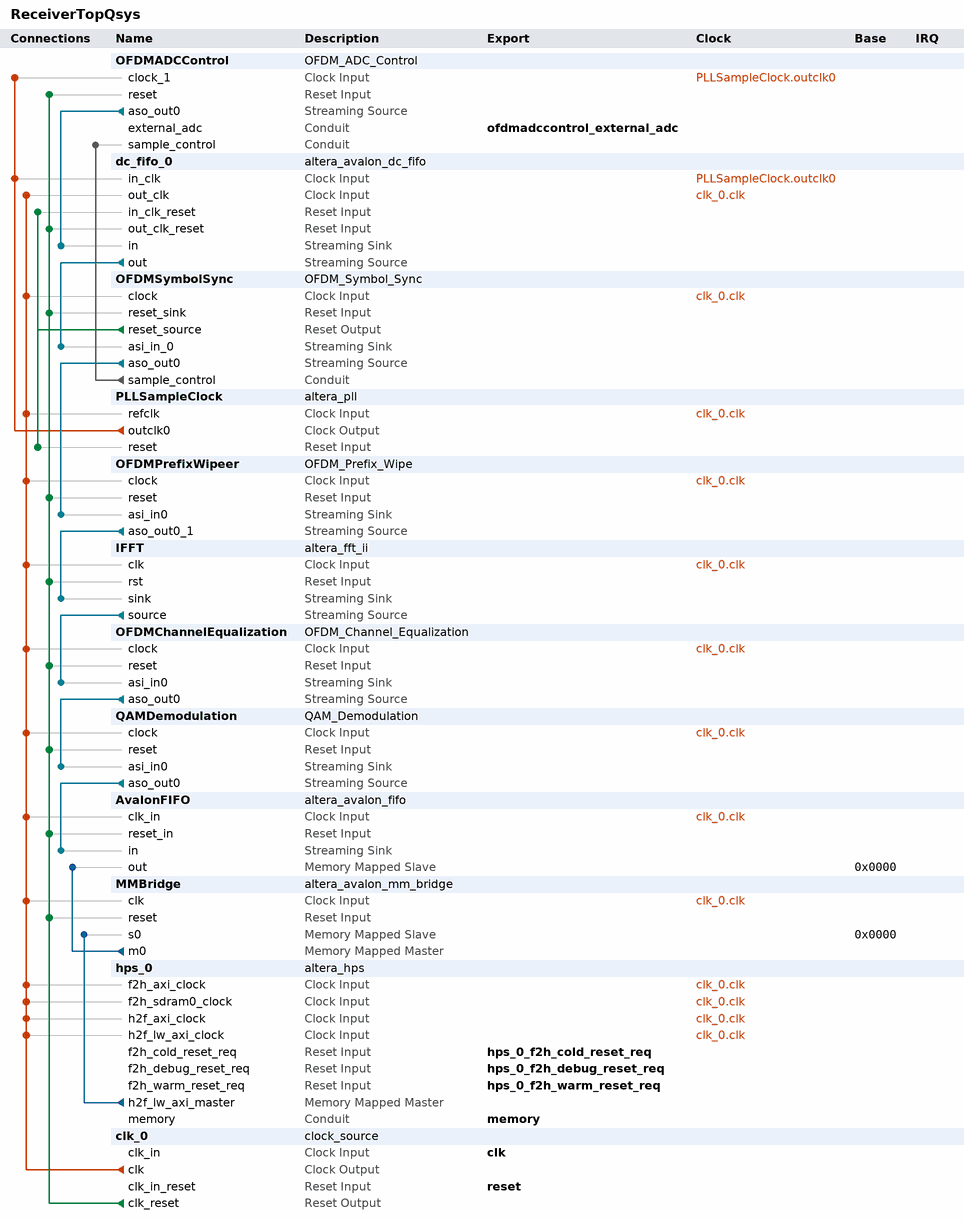
[diagram p0: system contents]
# Platform Designer (Qsys) system ReceiverTopQsys, Cyclone V 5CSXFC6D6F31C6
# Parameters at their usual value, and those the tool derives, are not listed.
package require -exact qsys 18.0
create_system ReceiverTopQsys
set_project_property DEVICE_FAMILY {Cyclone V}
set_project_property DEVICE 5CSXFC6D6F31C6

add_instance OFDMADCControl OFDM_ADC_Control 1.0

add_instance dc_fifo_0 altera_avalon_dc_fifo 18.0
set_instance_parameter_value dc_fifo_0 BITS_PER_SYMBOL 32
set_instance_parameter_value dc_fifo_0 FIFO_DEPTH 1024
set_instance_parameter_value dc_fifo_0 USE_PACKETS 1

add_instance OFDMSymbolSync OFDM_Symbol_Sync 1.0

add_instance PLLSampleClock altera_pll 18.0
set_instance_parameter_value PLLSampleClock gui_device_speed_grade 2
set_instance_parameter_value PLLSampleClock gui_number_of_clocks 1
set_instance_parameter_value PLLSampleClock gui_operation_mode direct
set_instance_parameter_value PLLSampleClock gui_output_clock_frequency0 40.0
set_instance_parameter_value PLLSampleClock gui_pll_mode {Fractional-N PLL}
set_instance_parameter_value PLLSampleClock gui_reference_clock_frequency 50.0
set_instance_parameter_value PLLSampleClock gui_use_locked true

add_instance OFDMPrefixWipeer OFDM_Prefix_Wipe 1.0

add_instance IFFT altera_fft_ii 18.0
set_instance_parameter_value IFFT data_flow Streaming
set_instance_parameter_value IFFT data_rep {Block Floating Point}
set_instance_parameter_value IFFT engine_arch {Quad Output}
set_instance_parameter_value IFFT in_width 14
set_instance_parameter_value IFFT length 1024
set_instance_parameter_value IFFT out_order Natural
set_instance_parameter_value IFFT out_width 29
set_instance_parameter_value IFFT twid_width 14

add_instance OFDMChannelEqualization OFDM_Channel_Equalization 1.0

add_instance QAMDemodulation QAM_Demodulation 1.0

add_instance AvalonFIFO altera_avalon_fifo 18.0
set_instance_parameter_value AvalonFIFO bitsPerSymbol 8
set_instance_parameter_value AvalonFIFO channelWidth 8
set_instance_parameter_value AvalonFIFO errorWidth 8
set_instance_parameter_value AvalonFIFO fifoDepth 16
set_instance_parameter_value AvalonFIFO fifoInputInterfaceOptions AVALONST_SINK
set_instance_parameter_value AvalonFIFO fifoOutputInterfaceOptions AVALONMM_READ
set_instance_parameter_value AvalonFIFO singleClockMode true
set_instance_parameter_value AvalonFIFO symbolsPerBeat 4
set_instance_parameter_value AvalonFIFO useIRQ true
set_instance_parameter_value AvalonFIFO usePacket true
set_instance_parameter_value AvalonFIFO useReadControl false

add_instance MMBridge altera_avalon_mm_bridge 18.0
set_instance_parameter_value MMBridge ADDRESS_UNITS SYMBOLS
set_instance_parameter_value MMBridge ADDRESS_WIDTH 10
set_instance_parameter_value MMBridge DATA_WIDTH 32
set_instance_parameter_value MMBridge MAX_PENDING_RESPONSES 4
set_instance_parameter_value MMBridge USE_AUTO_ADDRESS_WIDTH 0

add_instance hps_0 altera_hps 18.0
set_instance_parameter_value hps_0 EMAC1_Mode RGMII
set_instance_parameter_value hps_0 EMAC1_PinMuxing {HPS I/O Set 0}
set_instance_parameter_value hps_0 F2SCLK_COLDRST_Enable true
set_instance_parameter_value hps_0 F2SCLK_DBGRST_Enable true
set_instance_parameter_value hps_0 F2SCLK_WARMRST_Enable true
set_instance_parameter_value hps_0 F2SDRAM_Type {Avalon-MM Bidirectional}
set_instance_parameter_value hps_0 F2SDRAM_Width 64
set_instance_parameter_value hps_0 F2SINTERRUPT_Enable true
set_instance_parameter_value hps_0 F2S_Width 2
set_instance_parameter_value hps_0 FPGA_PERIPHERAL_OUTPUT_CLOCK_FREQ_EMAC0_GTX_CLK 125
set_instance_parameter_value hps_0 FPGA_PERIPHERAL_OUTPUT_CLOCK_FREQ_EMAC0_MD_CLK 2.5
set_instance_parameter_value hps_0 FPGA_PERIPHERAL_OUTPUT_CLOCK_FREQ_EMAC1_GTX_CLK 125
set_instance_parameter_value hps_0 FPGA_PERIPHERAL_OUTPUT_CLOCK_FREQ_EMAC1_MD_CLK 2.5
set_instance_parameter_value hps_0 HPS_PROTOCOL DDR3
set_instance_parameter_value hps_0 I2C0_Mode N/A
set_instance_parameter_value hps_0 I2C0_PinMuxing Unused
set_instance_parameter_value hps_0 I2C1_Mode N/A
set_instance_parameter_value hps_0 I2C1_PinMuxing Unused
set_instance_parameter_value hps_0 LWH2F_Enable true
set_instance_parameter_value hps_0 MEM_BANKADDR_WIDTH 3
set_instance_parameter_value hps_0 MEM_CLK_FREQ 400.0
set_instance_parameter_value hps_0 MEM_COL_ADDR_WIDTH 10
set_instance_parameter_value hps_0 MEM_DQ_WIDTH 32
set_instance_parameter_value hps_0 MEM_DRV_STR RZQ/6
set_instance_parameter_value hps_0 MEM_ROW_ADDR_WIDTH 15
set_instance_parameter_value hps_0 MEM_RTT_NOM {ODT Disabled}
set_instance_parameter_value hps_0 MEM_RTT_WR {Dynamic ODT off}
set_instance_parameter_value hps_0 MEM_TCL 11
set_instance_parameter_value hps_0 MEM_TFAW_NS 45.0
set_instance_parameter_value hps_0 MEM_TRAS_NS 35.0
set_instance_parameter_value hps_0 MEM_TRCD_NS 13.75
set_instance_parameter_value hps_0 MEM_TRFC_NS 260.0
set_instance_parameter_value hps_0 MEM_TRP_NS 13.75
set_instance_parameter_value hps_0 MEM_VENDOR Micron
set_instance_parameter_value hps_0 MEM_WTCL 7
set_instance_parameter_value hps_0 QSPI_Mode {1 SS}
set_instance_parameter_value hps_0 QSPI_PinMuxing {HPS I/O Set 0}
set_instance_parameter_value hps_0 REF_CLK_FREQ 50.0
set_instance_parameter_value hps_0 S2FCLK_USER2CLK 5
set_instance_parameter_value hps_0 S2F_Width 2
set_instance_parameter_value hps_0 SDIO_Mode {4-bit Data}
set_instance_parameter_value hps_0 SDIO_PinMuxing {HPS I/O Set 0}
set_instance_parameter_value hps_0 SPIM1_Mode N/A
set_instance_parameter_value hps_0 SPIM1_PinMuxing Unused
set_instance_parameter_value hps_0 STM_Enable true
set_instance_parameter_value hps_0 TIMING_BOARD_AC_SKEW 0.02
set_instance_parameter_value hps_0 TIMING_BOARD_AC_TO_CK_SKEW 0.01
set_instance_parameter_value hps_0 TIMING_BOARD_DQ_TO_DQS_SKEW 0.05
set_instance_parameter_value hps_0 TIMING_BOARD_MAX_CK_DELAY 0.03
set_instance_parameter_value hps_0 TIMING_BOARD_MAX_DQS_DELAY 0.02
set_instance_parameter_value hps_0 TIMING_BOARD_SKEW_BETWEEN_DQS 0.06
set_instance_parameter_value hps_0 TIMING_BOARD_SKEW_CKDQS_DIMM_MAX 0.12
set_instance_parameter_value hps_0 TIMING_BOARD_SKEW_CKDQS_DIMM_MIN 0.06
set_instance_parameter_value hps_0 TIMING_BOARD_SKEW_WITHIN_DQS 0.01
set_instance_parameter_value hps_0 TIMING_TDH 65
set_instance_parameter_value hps_0 TIMING_TDQSCK 255
set_instance_parameter_value hps_0 TIMING_TDQSQ 125
set_instance_parameter_value hps_0 TIMING_TDS 30
set_instance_parameter_value hps_0 TIMING_TIH 140
set_instance_parameter_value hps_0 TIMING_TIS 190
set_instance_parameter_value hps_0 TIMING_TQSH 0.4
set_instance_parameter_value hps_0 UART0_Mode N/A
set_instance_parameter_value hps_0 UART0_PinMuxing Unused
set_instance_parameter_value hps_0 USB1_Mode SDR
set_instance_parameter_value hps_0 USB1_PinMuxing {HPS I/O Set 0}
set_instance_parameter_value hps_0 desired_cfg_clk_mhz 100.0
set_instance_parameter_value hps_0 desired_qspi_clk_mhz 400.0

add_instance clk_0 clock_source 18.0
set_instance_parameter_value clk_0 clockFrequency 50000000

# connections
add_connection clk_0.clk AvalonFIFO.clk_in clock
add_connection clk_0.clk dc_fifo_0.out_clk clock
add_connection clk_0.clk hps_0.f2h_axi_clock clock
add_connection clk_0.clk hps_0.f2h_sdram0_clock clock
add_connection clk_0.clk hps_0.h2f_axi_clock clock
add_connection clk_0.clk hps_0.h2f_lw_axi_clock clock
add_connection clk_0.clk IFFT.clk clock
add_connection clk_0.clk MMBridge.clk clock
add_connection clk_0.clk OFDMChannelEqualization.clock clock
add_connection clk_0.clk OFDMPrefixWipeer.clock clock
add_connection clk_0.clk OFDMSymbolSync.clock clock
add_connection clk_0.clk PLLSampleClock.refclk clock
add_connection clk_0.clk QAMDemodulation.clock clock
add_connection PLLSampleClock.outclk0 dc_fifo_0.in_clk clock
add_connection PLLSampleClock.outclk0 OFDMADCControl.clock_1 clock
add_connection clk_0.clk_reset AvalonFIFO.reset_in reset
add_connection clk_0.clk_reset dc_fifo_0.out_clk_reset reset
add_connection clk_0.clk_reset IFFT.rst reset
add_connection clk_0.clk_reset MMBridge.reset reset
add_connection clk_0.clk_reset OFDMADCControl.reset reset
add_connection clk_0.clk_reset OFDMChannelEqualization.reset reset
add_connection clk_0.clk_reset OFDMPrefixWipeer.reset reset
add_connection clk_0.clk_reset OFDMSymbolSync.reset_sink reset
add_connection clk_0.clk_reset QAMDemodulation.reset reset
add_connection OFDMSymbolSync.reset_source dc_fifo_0.in_clk_reset reset
add_connection OFDMSymbolSync.reset_source PLLSampleClock.reset reset
add_connection hps_0.h2f_lw_axi_master MMBridge.s0 avalon
set_connection_parameter_value hps_0.h2f_lw_axi_master/MMBridge.s0 baseAddress 0x0000
add_connection MMBridge.m0 AvalonFIFO.out avalon
set_connection_parameter_value MMBridge.m0/AvalonFIFO.out baseAddress 0x0000
add_connection dc_fifo_0.out OFDMSymbolSync.asi_in_0 avalon_streaming
add_connection IFFT.source OFDMChannelEqualization.asi_in0 avalon_streaming
add_connection OFDMADCControl.aso_out0 dc_fifo_0.in avalon_streaming
add_connection OFDMChannelEqualization.aso_out0 QAMDemodulation.asi_in0 avalon_streaming
add_connection OFDMPrefixWipeer.aso_out0_1 IFFT.sink avalon_streaming
add_connection OFDMSymbolSync.aso_out0 OFDMPrefixWipeer.asi_in0 avalon_streaming
add_connection QAMDemodulation.aso_out0 AvalonFIFO.in avalon_streaming
add_connection OFDMSymbolSync.sample_control OFDMADCControl.sample_control conduit

# exported interfaces
add_interface clk clock sink
set_interface_property clk EXPORT_OF clk_0.clk_in
add_interface hps_0_f2h_cold_reset_req reset sink
set_interface_property hps_0_f2h_cold_reset_req EXPORT_OF hps_0.f2h_cold_reset_req
add_interface hps_0_f2h_debug_reset_req reset sink
set_interface_property hps_0_f2h_debug_reset_req EXPORT_OF hps_0.f2h_debug_reset_req
add_interface hps_0_f2h_warm_reset_req reset sink
set_interface_property hps_0_f2h_warm_reset_req EXPORT_OF hps_0.f2h_warm_reset_req
add_interface memory conduit end
set_interface_property memory EXPORT_OF hps_0.memory
add_interface ofdmadccontrol_external_adc conduit end
set_interface_property ofdmadccontrol_external_adc EXPORT_OF OFDMADCControl.external_adc
add_interface reset reset sink
set_interface_property reset EXPORT_OF clk_0.clk_in_reset

set_interconnect_requirement {$system} qsys_mm.clockCrossingAdapter HANDSHAKE
set_interconnect_requirement {$system} qsys_mm.enableEccProtection FALSE
set_interconnect_requirement {$system} qsys_mm.insertDefaultSlave FALSE
set_interconnect_requirement {$system} qsys_mm.maxAdditionalLatency 1

save_system ReceiverTopQsys.qsys
